# Altium schematic sheet AMS LATCH.SchDoc
size 199 x 149 mm; SheetNumber: 1; SheetTotal: 1
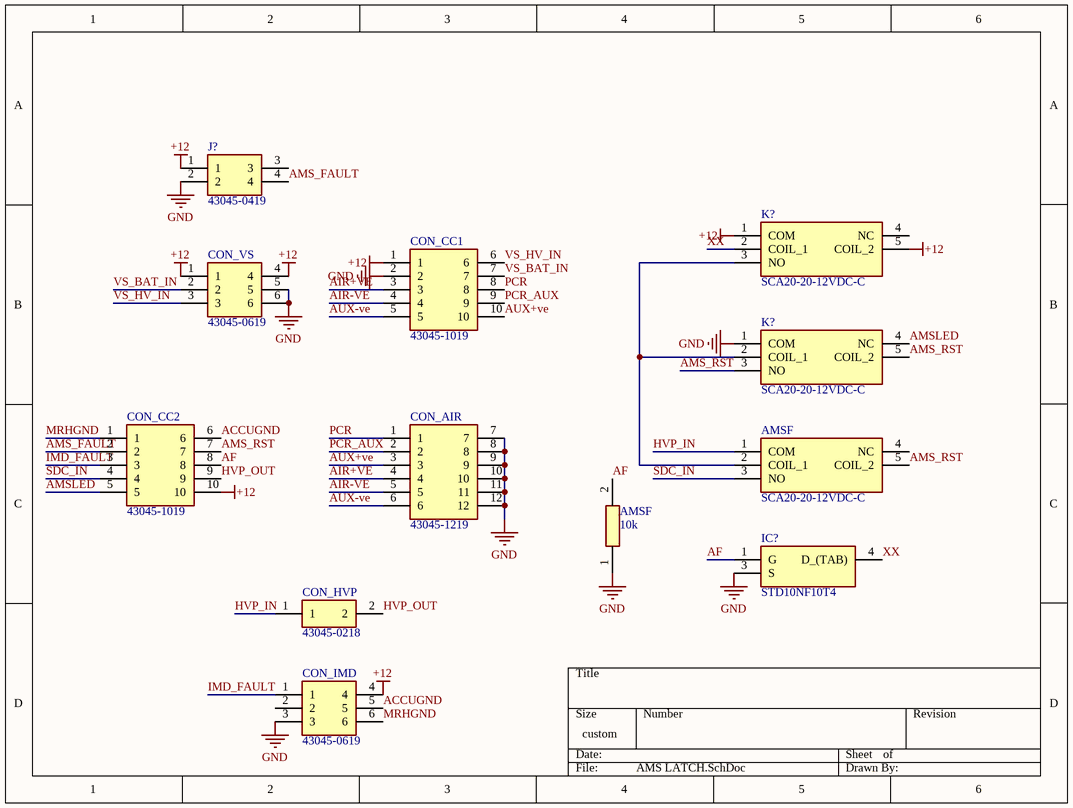
[diagram p0: AMS LATCH.SchDoc]

## Parts
(Parts that share a designator on the sheet are numbered #1, #2 ... from top to bottom, then left to right.)
AMSF#1  SCA20-20-12VDC-C  [SCA202012VDCC]
AMSF#2  10k  [RESC2012X60N]
CON_AIR  43045-1219  [43045-12YY_181920]
CON_CC1  43045-1019  [43045-10YY_181920]
CON_CC2  43045-1019  [43045-10YY_181920]
CON_HVP  43045-0218  [43045-02YY_181920]
CON_IMD  43045-0619  [43045-06YY_181920]
CON_VS  43045-0619  [43045-06YY_181920]
IC?  STD10NF10T4  [TO228P972X240-3N]
J?  43045-0419  [43045-04YY_181920]
K?#1  SCA20-20-12VDC-C  [SCA202012VDCC]
K?#2  SCA20-20-12VDC-C  [SCA202012VDCC]

## Nets
+12: CON_CC1.1 CON_CC2.10 CON_IMD.4 CON_VS.1 CON_VS.4 J?.1 K?#1.1(COM) K?#1.5(COIL_2)
GND: AMSF#2.1 CON_AIR.7 CON_AIR.8 CON_AIR.9 CON_AIR.10 CON_AIR.11 CON_AIR.12 CON_CC1.2 CON_IMD.3 CON_VS.5 CON_VS.6 IC?.3(S) J?.2 K?#2.1(COM)
ACCUGND: CON_CC2.6 CON_IMD.5
AF: AMSF#2.2 CON_CC2.8 IC?.1(G)
AIR+VE: CON_AIR.4 CON_CC1.3
AIR-VE: CON_AIR.5 CON_CC1.4
AMS_FAULT: CON_CC2.2 J?.4
AMS_RST: AMSF#1.5(COIL_2) CON_CC2.7 K?#2.3(NO) K?#2.5(COIL_2)
AMSLED: CON_CC2.5 K?#2.4(NC)
AUX+ve: CON_AIR.3 CON_CC1.10
AUX-ve: CON_AIR.6 CON_CC1.5
HVP_IN: AMSF#1.1(COM) CON_HVP.1
HVP_OUT: CON_CC2.9 CON_HVP.2
IMD_FAULT: CON_CC2.3 CON_IMD.1
MRHGND: CON_CC2.1 CON_IMD.6
PCR: CON_AIR.1 CON_CC1.8
PCR_AUX: CON_AIR.2 CON_CC1.9
SDC_IN: AMSF#1.3(NO) CON_CC2.4
VS_BAT_IN: CON_CC1.7 CON_VS.2
VS_HV_IN: CON_CC1.6 CON_VS.3
XX: IC?.4(D_(TAB)) K?#1.2(COIL_1)
NetAMSF#1_2: AMSF#1.2(COIL_1) K?#1.3(NO) K?#2.2(COIL_1)

Not connected (* = marked no-connect by the designer): AMSF#1 4(NC); CON_IMD 2; J? 3; K?#1 4(NC)

## Library data of the parts
AMSF#1 K?#1 K?#2 = SCA20-20-12VDC-C: Relay or Contactor; Manufacturer_Name: LEONE; Datasheet Link: https://www.kuraelectronics.com/new-pdf/SCA%2020.pdf; Height: 13.7mm; Manufacturer_Part_Number: SCA20-20-12VDC-C
AMSF#2 = RC0805JR-0710KL: Resistor; Manufacturer_Name: KEMET; Datasheet Link: http://www.yageo.com/documents/recent/PYu-RC_Group_51_RoHS_L_10.pdf; Height: 0.6mm; Manufacturer_Part_Number: RC0805JR-0710KL; Mouser Part Number: 603-RC0805JR-0710KL; Mouser Price/Stock: https://www.mouser.co.uk/ProductDetail/YAGEO/RC0805JR-0710KL?qs=ZFGQJeMQzF5q%2Fp77vM%2FrVQ%3D%3D; Arrow Part Number: RC0805JR-0710KL; Arrow Price/Stock: https://www.arrow.com/en/products/rc0805jr-0710kl/yageo
CON_AIR = 43045-1219: Connector; Manufacturer_Name: Molex; Datasheet Link: https://www.molex.com/pdm_docs/sd/430450218_sd.pdf; Height: 9.91mm; Manufacturer_Part_Number: 43045-1219; Mouser Part Number: 538-43045-1219; Mouser Price/Stock: https://www.mouser.co.uk/ProductDetail/Molex/43045-1219?qs=359VwiUTsp3iCU2NVYxNVg%3D%3D
CON_CC1 CON_CC2 = 43045-1019: Connector; Manufacturer_Name: Molex; Datasheet Link: https://www.molex.com/pdm_docs/sd/430450218_sd.pdf; Height: 9.91mm; Manufacturer_Part_Number: 43045-1019; Mouser Part Number: 538-43045-1019; Mouser Price/Stock: https://www.mouser.co.uk/ProductDetail/Molex/43045-1019?qs=OWQJ9aScCGICje0BO%252BCnwQ%3D%3D; Arrow Part Number: 43045-1019; Arrow Price/Stock: https://www.arrow.com/en/products/43045-1019/molex?region=nac
CON_HVP = 43045-0218: Connector; Manufacturer_Name: Molex; Datasheet Link: https://www.molex.com/pdm_docs/sd/430450218_sd.pdf; Height: 9.91mm; Manufacturer_Part_Number: 43045-0218; Mouser Part Number: 538-43045-0218; Mouser Price/Stock: https://www.mouser.co.uk/ProductDetail/Molex/43045-0218?qs=4XSMV6Twtb2qUKINalLbdA%3D%3D; Arrow Part Number: 43045-0218; Arrow Price/Stock: https://www.arrow.com/en/products/43045-0218/molex
CON_IMD CON_VS = 43045-0619: Connector; Manufacturer_Name: Molex; Datasheet Link: https://www.molex.com/pdm_docs/sd/430450218_sd.pdf; Height: 9.91mm; Manufacturer_Part_Number: 43045-0619; Mouser Part Number: 538-43045-0619; Mouser Price/Stock: https://www.mouser.co.uk/ProductDetail/Molex/43045-0619?qs=KC2ywxza1kr7EVu5MuTw7g%3D%3D; Arrow Part Number: 43045-0619; Arrow Price/Stock: https://www.arrow.com/en/products/43045-0619/molex
IC? = STD10NF10T4: Integrated Circuit; Manufacturer_Name: STMicroelectronics; Datasheet Link: http://www.st.com/web/en/resource/technical/document/datasheet/CD00002133.pdf; Height: 2.4mm; Manufacturer_Part_Number: STD10NF10T4; Mouser Part Number: 511-STD10NF10; Mouser Price/Stock: https://www.mouser.co.uk/ProductDetail/STMicroelectronics/STD10NF10T4?qs=El1T93pd01%2FBh%252BX9NfIsIQ%3D%3D; Arrow Part Number: STD10NF10T4; Arrow Price/Stock: https://www.arrow.com/en/products/std10nf10t4/stmicroelectronics
J? = 43045-0419: Connector; Manufacturer_Name: Molex; Datasheet Link: https://www.molex.com/pdm_docs/sd/430450218_sd.pdf; Height: 9.91mm; Manufacturer_Part_Number: 43045-0419; Mouser Part Number: 538-43045-0419; Mouser Price/Stock: https://www.mouser.co.uk/ProductDetail/Molex/43045-0419?qs=UeCeOHRHQebVNIQyI9VWWg%3D%3D